# Altium schematic sheet PLMGTBanks.SchDoc
size A4; SheetNumber: 13; SheetTotal: 18
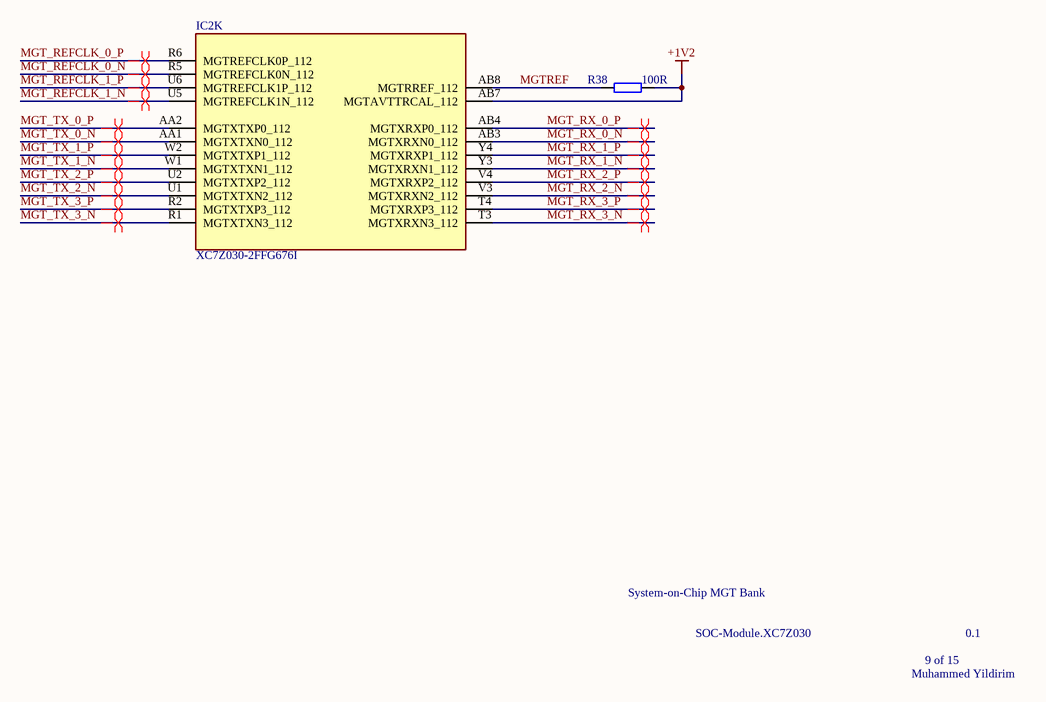
[diagram p0: PLMGTBanks.SchDoc]

## Parts
IC2  XC7Z030-2FFG676I  [BGA676C100P26X26_2700X2700X324]  (part K of 15)
R38  100R  [RES_0201]

## Nets
+1V2: IC2.AB7(MGTAVTTRCAL_112) R38.2
MGT_REFCLK_0_N: IC2.R5(MGTREFCLK0N_112)
MGT_REFCLK_0_P: IC2.R6(MGTREFCLK0P_112)
MGT_REFCLK_1_N: IC2.U5(MGTREFCLK1N_112)
MGT_REFCLK_1_P: IC2.U6(MGTREFCLK1P_112)
MGT_RX_0_N: IC2.AB3(MGTXRXN0_112)
MGT_RX_0_P: IC2.AB4(MGTXRXP0_112)
MGT_RX_1_N: IC2.Y3(MGTXRXN1_112)
MGT_RX_1_P: IC2.Y4(MGTXRXP1_112)
MGT_RX_2_N: IC2.V3(MGTXRXN2_112)
MGT_RX_2_P: IC2.V4(MGTXRXP2_112)
MGT_RX_3_N: IC2.T3(MGTXRXN3_112)
MGT_RX_3_P: IC2.T4(MGTXRXP3_112)
MGT_TX_0_N: IC2.AA1(MGTXTXN0_112)
MGT_TX_0_P: IC2.AA2(MGTXTXP0_112)
MGT_TX_1_N: IC2.W1(MGTXTXN1_112)
MGT_TX_1_P: IC2.W2(MGTXTXP1_112)
MGT_TX_2_N: IC2.U1(MGTXTXN2_112)
MGT_TX_2_P: IC2.U2(MGTXTXP2_112)
MGT_TX_3_N: IC2.R1(MGTXTXN3_112)
MGT_TX_3_P: IC2.R2(MGTXTXP3_112)
MGTREF: IC2.AB8(MGTRREF_112) R38.1

## Layout directives
differential pair: MGT_REFCLK_0_N, MGT_REFCLK_0_P, MGT_REFCLK_1_N, MGT_REFCLK_1_P, MGT_RX_0_N, MGT_RX_0_P, MGT_RX_1_N, MGT_RX_1_P, MGT_RX_2_N, MGT_RX_2_P, MGT_RX_3_N, MGT_RX_3_P, MGT_TX_0_N, MGT_TX_0_P, MGT_TX_1_N, MGT_TX_1_P, MGT_TX_2_N, MGT_TX_2_P, MGT_TX_3_N, MGT_TX_3_P

## Notes on the sheet
- System-on-Chip MGT Bank
- SOC-Module.XC7Z030
- 9 of 15
- 0.1
- Muhammed Yildirim

## Library data of the parts
IC2 = XC7Z030-2FFG676I: Integrated Circuit; Manufacturer_Name: AMD; Datasheet Link: http://www.xilinx.com/support/documentation/data_sheets/ds190-Zynq-7000-Overview.pdf; Height: 3.24mm; Manufacturer_Part_Number: XC7Z030-2FFG676I; Mouser Part Number: 217-XC7Z030-2FFG676I; Mouser Price/Stock: https://www.mouser.co.uk/ProductDetail/Xilinx/XC7Z030-2FFG676I?qs=rrS6PyfT74cuZK5O3CSpmw%3D%3D
R38 = RES_0201: Resistor SMD 0201; Manufacturer: *; Manufacturer Part Number: *; Distributor Link: *; LCSC: *